# Altium schematic sheet USB_OTG_FS.SchDoc: USB_OTG_FS
size A4; DocumentNumber: MB1165; Revision: C.1; SheetNumber: 9; SheetTotal: 17; Project: STM32469I-EVAL
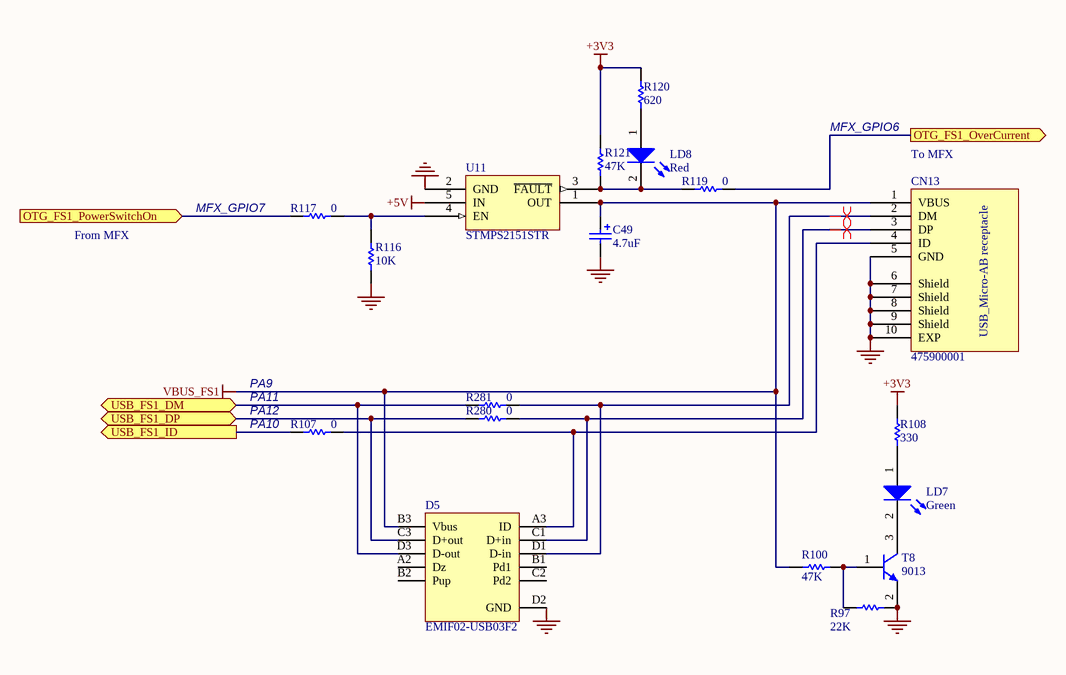
[diagram p0: USB_OTG_FS.SchDoc]

## Parts
C49  4.7uF  [TAN-A]
CN13  475900001  [MOLEX_47590001]
D5  EMIF02-USB03F2  [BGA11_0R5_1R57X2R07]
LD7  Green  [0603D]
LD8  Red  [0603D]
R97  22K  [0603R]
R100  47K  [0603R]
R107  0  [0603R]
R108  330  [0603R]
R116  10K  [0603R]
R117  0  [0603R]
R119  0  [0603R]
R120  620  [0603R]
R121  47K  [0603R]
R280  0  [0603R]
R281  0  [0603R]
T8  9013  [SOT-23]
U11  STMPS2151STR  [SOT23-5]

## Ports
OTG_FS1_OverCurrent (out), OTG_FS1_PowerSwitchOn (in), USB_FS1_DM (bidir), USB_FS1_DP (bidir), USB_FS1_ID (out)

## Nets
+3V3: R108.2 R120.2 R121.1
+5V: U11.5(IN)
GND: C49.2 CN13.5(GND) CN13.6(Shield) CN13.7(Shield) CN13.8(Shield) CN13.9(Shield) CN13.10(EXP) D5.D2(GND) R97.1 R116.1 T8.2(E) U11.2(GND)
VBUS_FS1: C49.1 CN13.1(VBUS) D5.B3(Vbus) R100.1 U11.1(OUT)
OTG_FS1_OverCurrent: R119.1 ; port OTG_FS1_OverCurrent
OTG_FS1_PowerSwitchOn: R117.2 ; port OTG_FS1_PowerSwitchOn
USB_FS1_DM: D5.D3(D-out) R281.2 ; port USB_FS1_DM
USB_FS1_DP: D5.C3(D+out) R280.2 ; port USB_FS1_DP
USB_FS1_ID: R107.2 ; port USB_FS1_ID
NetCN13_2: CN13.2(DM) D5.D1(D-in) R281.1
NetCN13_3: CN13.3(DP) D5.C1(D+in) R280.1
NetCN13_4: CN13.4(ID) D5.A3(ID) R107.1
NetLD7_1: LD7.1(A) R108.1
NetLD7_2: LD7.2(K) T8.3(C)
NetLD8_1: LD8.1(A) R120.1
NetLD8_2: LD8.2(K) R119.2 R121.2 U11.3(~{FAULT})
NetR97_2: R97.2 R100.2 T8.1(B)
NetR116_2: R116.2 R117.1 U11.4(EN)

Not connected (* = marked no-connect by the designer): D5 A2(Dz) B1(Pd1) B2(Pup) C2(Pd2)

## Layout directives
differential pair: NetCN13_2, NetCN13_3

## Notes on the sheet
- MFX_GPIO6
- (near R117) MFX_GPIO7
- (near CN13) To MFX
- From MFX
- PA9
- (near R107) PA11
- (near R107) PA12
- (near R107) PA10
- Title:
- Project:
- Size:
- Date:
- A4
- Reference:
- Sheet:
- Revision:
- of
- (in symbol 475900001) USB_Micro-AB receptacle

## Library data of the parts
C49 = Cap Pol1: Polarized Capacitor (Radial); Value: 47uF; Published: 8-Jun-2000; Revision: July-2002: Re-released for DXP Platform.; Publisher: Altium Limited
LD7 LD8 = LED2: Typical RED, GREEN, YELLOW, AMBER GaAs LED; Published: 8-Jun-2000; Revision: July-2002: Re-released for DXP Platform.; Publisher: Altium Limited
R97 R100 R108 R121 = res1: Resistor; Value: 1K; Published: 8-Jun-2000; Revision: July-2002: Re-released for DXP Platform.; Publisher: Altium Limited
R107 R116 R117 R119 R120 R280 R281 = Res1: Resistor; Value: 1K; Published: 8-Jun-2000; Revision: July-2002: Re-released for DXP Platform.; Publisher: Altium Limited
T8 = NPN: NPN Bipolar Transistor; Code - JEDEC: TO-226-AA; Published: 8-Jun-2000; Revision: July-2002: Re-released for DXP Platform.; Publisher: Altium Limited
U11 = STMPS2141STR